# EAGLE design nanoheater (EAGLE 7.3.0)
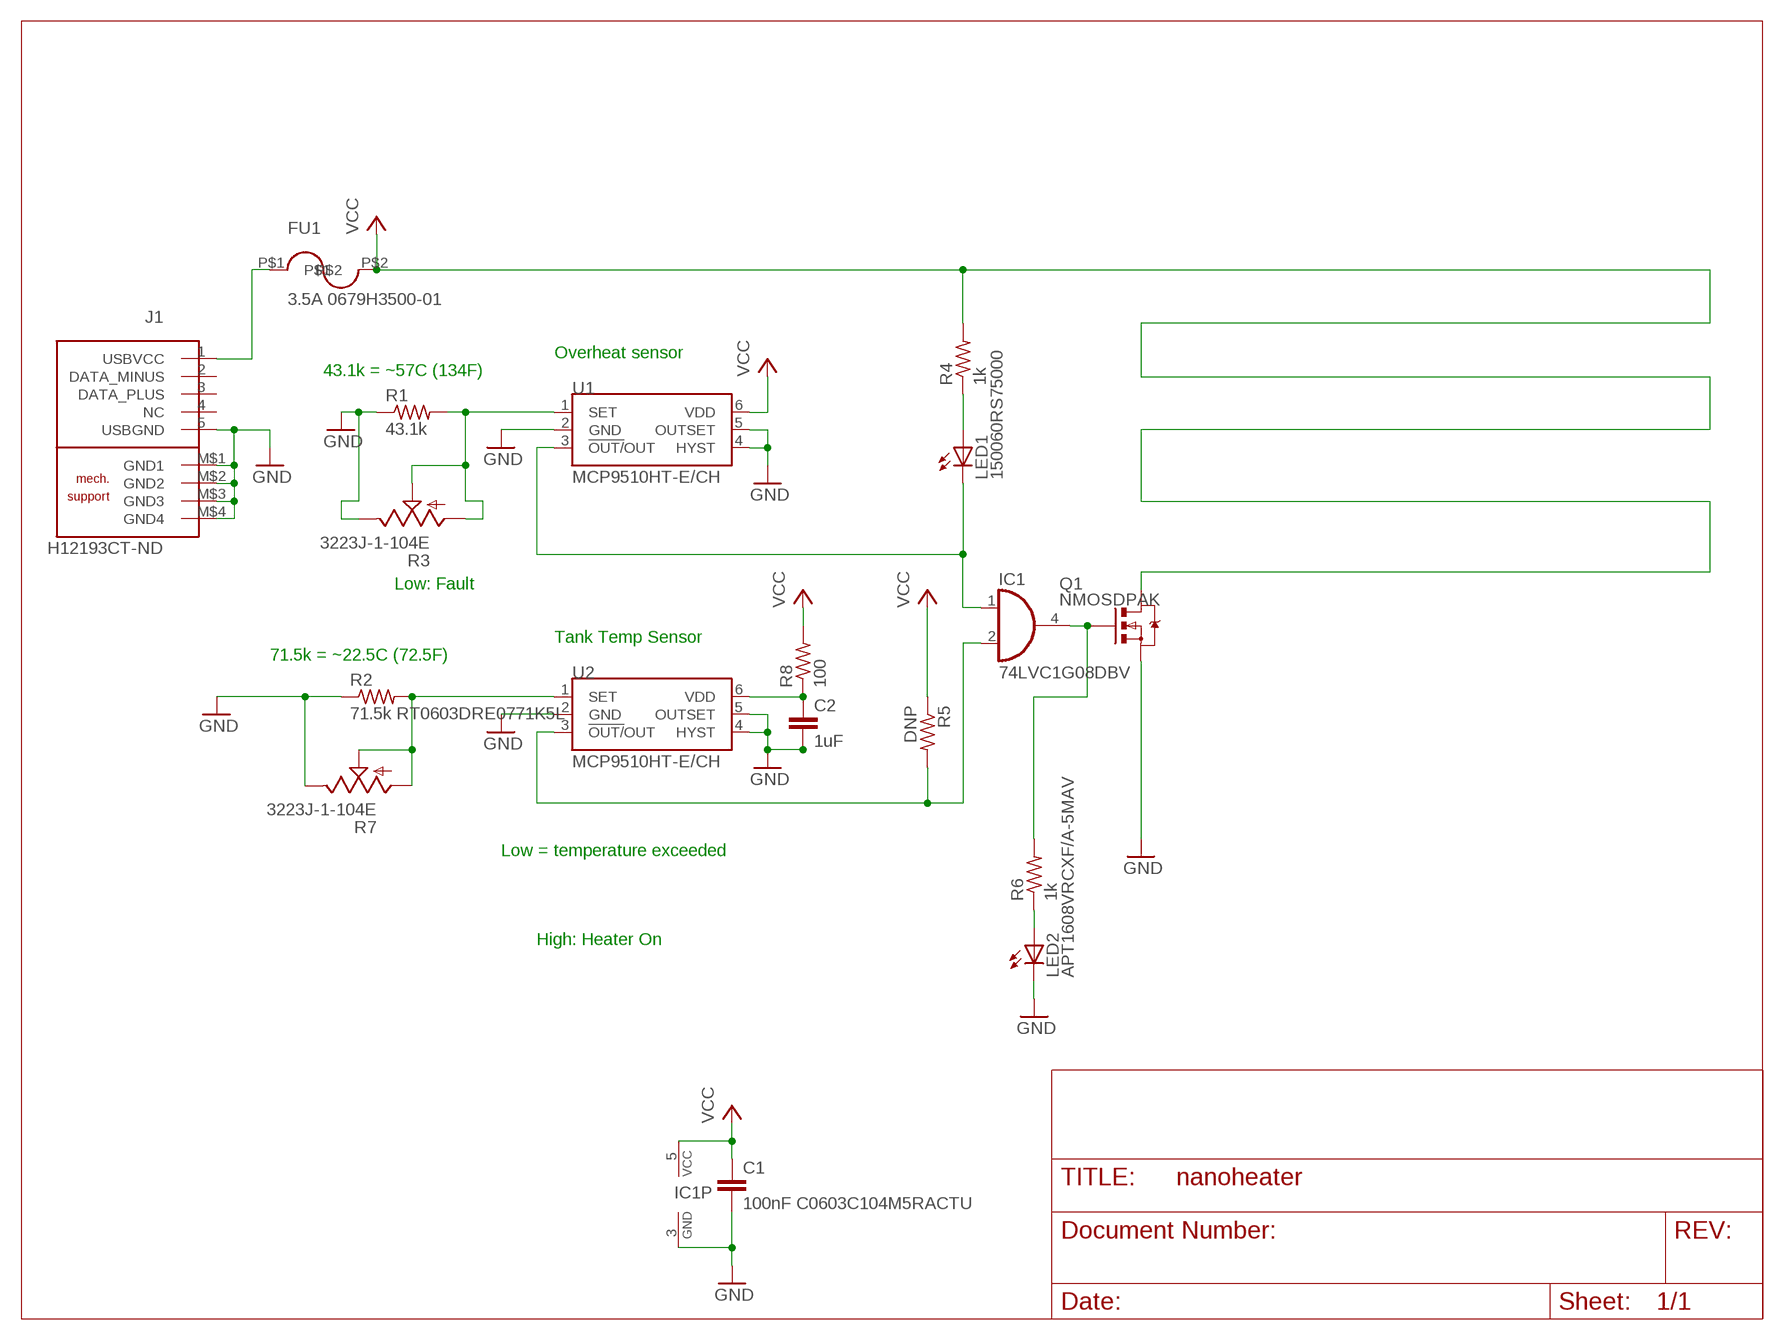
[diagram p0: schematic, sheet 1]

## Parts
C1  100nF C0603C104M5RACTU  C-EUC0603  [C0603]
C2  1uF  C-EUC0603  [C0603]
FU1  3.5A 0679H3500-01  FUSE_2410  [2410]
IC1  74LVC1G08DBV  [SOT23-5]
J1  H12193CT-ND  ZX62-B-5P_MICRO_USBW  [ZX62WD1-B-5PC_MICRO_USB]
LED1  150060RS75000  LEDCHIP-LED0603  [CHIP-LED0603]
LED2  APT1608VRCXF/A-5MAV  LEDCHIP-LED0603  [CHIP-LED0603]
Q1  NMOSDPAK  [DPAK]
R1  43.1k  R-US_R0603  [R0603]
R2  71.5k RT0603DRE0771K5L  R-US_R0603  [R0603]
R3  3223J-1-104E  TRIM_US-3223J  [3223J]
R4  1k  R-US_R0603  [R0603]
R5  DNP  R-US_R0603  [R0603]
R6  1k  R-US_R0603  [R0603]
R7  3223J-1-104E  TRIM_US-3223J  [3223J]
R8  100  R-US_R0603  [R0603]
U1  MCP9510HT-E/CH  MCP9509_9510  [SOT23-6]
U2  MCP9510HT-E/CH  MCP9509_9510  [SOT23-6]

## Nets
GND: C1.2 C2.2 IC1.3(GND) J1.5(USBGND) J1.M$1(GND1) J1.M$2(GND2) J1.M$3(GND3) J1.M$4(GND4) LED2.C Q1.3(S) R1.1 R2.1 R3.3(E) R7.3(E) U1.2(GND) U1.4(HYST) U1.5(OUTSET) U2.2(GND) U2.4(HYST) U2.5(OUTSET)
N$1: IC1.1(I0) LED1.C U1.3(!OUT/!OUT)
N$2: IC1.2(I1) R5.2 U2.3(!OUT/!OUT)
N$3: FU1.P$1 J1.1(USBVCC)
N$4: IC1.4(O) Q1.1(G) R6.2
N$5: LED1.A R4.1
N$6: R1.2 R3.1(A) R3.2(S) U1.1(SET)
N$8: LED2.A R6.1
N$10: R2.2 R7.1(A) R7.2(S) U2.1(SET)
N$11: C2.1 R8.1 U2.6(VDD)
VCC: C1.1 FU1.P$2 IC1.5(VCC) Q1.2(D) R4.2 R5.1 R8.2 U1.6(VDD)
Unconnected: J1.2(DATA_MINUS) J1.3(DATA_PLUS) J1.4(NC)

## Notes on the sheet
- Overheat sensor
- 43.1k = ~57C (134F)
- Low: Fault
- Tank Temp Sensor
- 71.5k = ~22.5C (72.5F)
- Low = temperature exceeded
- High: Heater On

## Library data of the parts
C1 C2 = rcl:C-EU: CAPACITOR, European symbol
FU1 = tim:FUSE_2410
IC1 = 74xx-little-de:74*1G08: 2-input AND gate
J1 = mideeval:ZX62-B-5P_MICRO_USB: Hirose micro-USB B end, SMT bottom mount. 20120627 / tgipson
LED1 LED2 = led:LED: LED OSRAM: - CHIPLED LG R971, LG N971, LY N971, LG Q971, LY Q971, LO R971, LY R971 LH N974, LH R974 LS Q976, LO Q976, LY Q976 LO Q996 - Hyper CHIPLED LW Q18S LB Q993, LB Q99A, LB R99A - SideLED LS A670, LO A670, LY A670, LG A670, LP A670 LB A673, LV A673, LT A673, LW A673 LH A674 LY A675 LS A676, LA A676, LO A676, LY A676, LW A676 LS A679, LY A679, LG A679 - Hyper Micro SIDELED® LS Y876, LA Y876, LO Y876, LY Y876 LT Y87S - SmartLED LW L88C, LW L88S LB L89C, LB L89S, LG L890 LS L89K, LO L89K, LY L89K LS L896, LA L896, LO L896, LY L896 - TOPLED LS T670, LO T670, LY T670, LG T670, LP T670 LSG T670, LSP T670, LSY T670, LOP T670, LYG T670 LG T671, LOG T671, LSG T671 LB T673, LV T673, LT T673, LW T673 LH T674 LS T676, LA T676, LO T676, LY T676, LB T676, LH T676, LSB T676, LW T676 LB T67C, LV T67C, LT T67C, LS T67K, LO T67K, LY T67K, LW E67C LS E67B, LA E67B, LO E67B, LY E67B, LB E67C, LV E67C, LT E67C LW T67C LS T679, LY T679, LG T679 LS T770, LO T770, LY T770, LG T770, LP T770 LB T773, LV T773, LT T773, LW T773 LH T774 LS E675, LA E675, LY E675, LS T675 LS T776, LA T776, LO T776, LY T776, LB T776 LHGB T686 LT T68C, LB T68C - Hyper Mini TOPLED® LB M676 - Mini TOPLED Santana® LG M470 LS M47K, LO M47K, LY M47K Source: http://www.osram.convergy.de LUXEON: - LUMILED® LXK2-PW12-R00, LXK2-PW12-S00, LXK2-PW14-U00, LXK2-PW14-V00 LXK2-PM12-R00, LXK2-PM12-S00, LXK2-PM14-U00 LXK2-PE12-Q00, LXK2-PE12-R00, LXK2-PE12-S00, LXK2-PE14-T00, LXK2-PE14-U00 LXK2-PB12-K00, LXK2-PB12-L00, LXK2-PB12-M00, LXK2-PB14-N00, LXK2-PB14-P00, LXK2-PB14-Q00 LXK2-PR12-L00, LXK2-PR12-M00, LXK2-PR14-Q00, LXK2-PR14-R00 LXK2-PD12-Q00, LXK2-PD12-R00, LXK2-PD12-S00 LXK2-PH12-R00, LXK2-PH12-S00 LXK2-PL12-P00, LXK2-PL12-Q00, LXK2-PL12-R00 Source: www.luxeon.com KINGBRIGHT: KA-3528ASYC Source: www.kingbright.com
Q1 = tim:NMOS
R1 R2 R4-R6 R8 = rcl:R-US_: RESISTOR, American symbol
R3 R7 = pot:TRIM_US-: POTENTIOMETER
U1 U2 = tim:MCP9509_9510

## Board
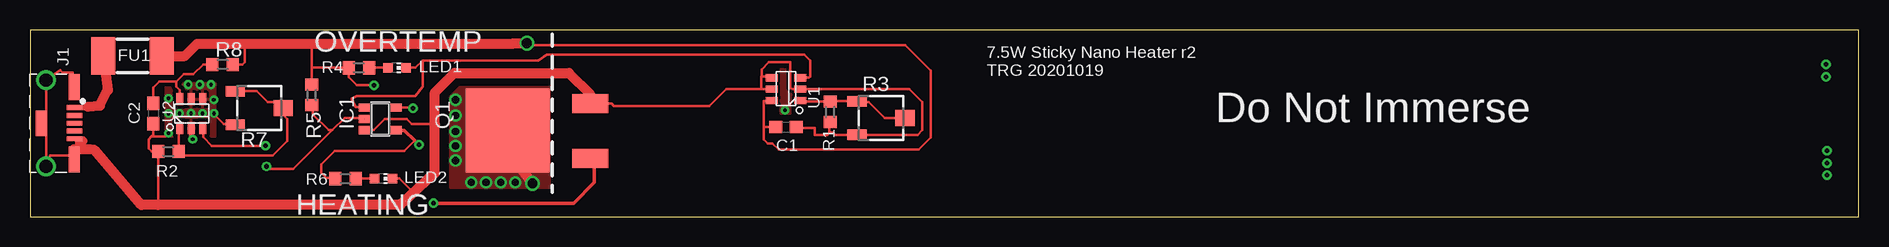
[diagram p1: board, top side]
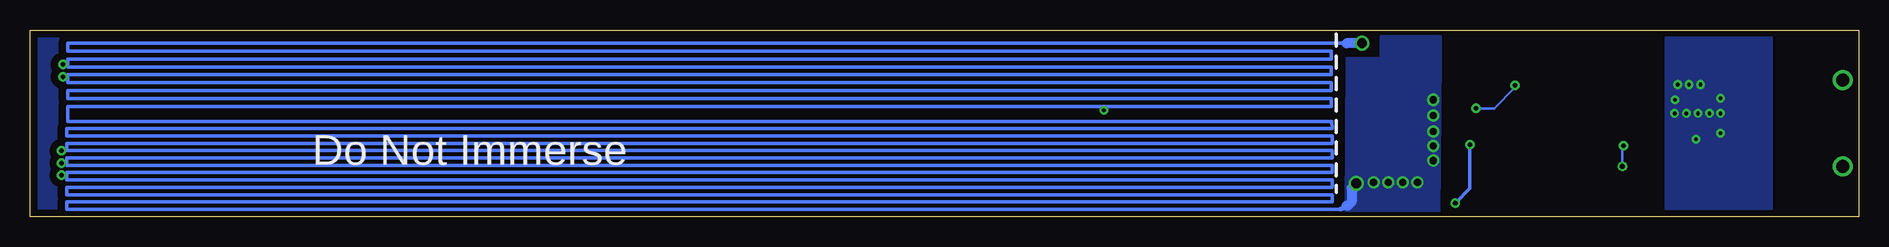
[diagram p2: board, bottom side, seen from below]

Size 152.4 x 15.59 mm. Coordinates in mm from the lower left corner, seen from the top.
Outline: 0,0 152.4,0 152.4,15.59 0,15.59 0,0
Copper layers (1*16): Top 0.035mm / dielectric 1.5mm / Bottom 0.035mm
Design rules "default *": minimum track width 10mil, minimum drill 24mil, track to track 8mil, track to pad 8mil, pad to pad 8mil, via to via 8mil, smd to smd 8mil, copper to edge 15mil, drill to drill 8mil, minimum pad ring 10mil, minimum via ring 8mil, stop-mask expansion 4mil, vias tented up to drill 0mil, thermal gap 10mil

### Footprints (pad centres in the part's own frame; a part is rotated, then mirrored left to right if it is on the bottom)
C0603 = smd 1.1 x 1: 1 -0.85,0; 2 0.85,0
2410 = smd 2 x 3.15: P$1 -2.45,0; P$2 2.45,0
SOT23-5 = smd 0.69 x 0.99: 1 -0.95,-1.29; 2 0,-1.29; 3 0.95,-1.29; 4 0.95,1.3; 5 -0.95,1.3
ZX62WD1-B-5PC_MICRO_USB = smd 0.4 x 1.3: 1 -1.3,1.965; 2 -0.65,1.965; 3 0,1.965; 4 0.65,1.965; 5 1.3,1.965 | smd 2.15 x 0.9: M$1 -3.025,1.935; M$2 3.027,1.933; M$5 0,-0.815 | drill 1.1 pad 1.27: M$3 -3.61,-0.415; M$4 3.61,-0.415
CHIP-LED0603 = smd 0.8 x 0.8: A 0,-0.75; C 0,0.75
DPAK = smd 1.6 x 3: 1 -2.269,-1.515; 3 2.311,-1.515 | smd 7 x 7: 2 0.046,5.34
R0603 = smd 1 x 1.1: 1 -0.85,0; 2 0.85,0
3223J = smd 1.6 x 0.9: 1 -2,1.4; 3 -2,-1.4 | smd 1.6 x 1.3: 2 2,0
SOT23-6 = smd 0.6 x 1: 1 -0.95,-1.2; 2 0,-1.2; 3 0.95,-1.2; 4 0.95,1.2; 5 0,1.2; 6 -0.95,1.2

### Placement (x,y rotation side)
C1  62.99,7.47 0 top
C2  10.26,8.61 270 top
FU1  8.53,13.41 0 top
IC1  29.18,8.15 270 top
J1  1.75,7.8 270 top
LED1  30.58,12.42 270 top
LED2  29.46,3.17 270 top
Q1  45.16,7.14 90 top
R1  66.67,8.74 90 top
R2  11.53,5.44 0 top
R3  70.92,8.23 0 top
R4  27.41,12.42 180 top
R5  23.47,10.16 270 top
R6  26.29,3.17 180 top
R7  19.1,9.07 0 top
R8  16.05,12.7 0 top
U1  62.99,10.64 90 top
U2  13.44,8.61 0 top

### Tracks (layer width: path | path; a pad name or v marks a point on that pad's centre or on a via)
GND  (via drill 0.3)
  Top 0.203: 61.79,11.68 60.94,11.68 | 60.94,11.68 60.94,10.64 | 60.94,10.64 U1.5 | 63.84,7.42 65.41,7.42 65.41,6.81 66.42,6.81 66.62,7.01 | 66.62,7.01 66.62,7.84 | 60.94,11.68 60.96,11.71 60.96,12.27 61.57,12.88 63.35,12.88 63.35,10.74 63.55,10.64 U1.2 67.41,10.64 67.44,10.67 73.25,10.67 74.37,9.55 74.37,7.21 73.99,6.83 R3.3 68.89,6.81 67.16,6.81 66.95,7.01 66.62,7.01 | 10.11,6.68 9.88,6.45 9.88,5.69 10.13,5.44 R2.1 10.68,4.63 10.67,4.34 10.67,0.96 | 10.11,6.68 10.26,6.83 C2.2 | 60.94,10.64 58.01,10.64 56.62,9.25 48.67,9.25 48.46,9.45 Q1.3 | 66.84,8.05 R1.1 | J1.M$1 3.56,12.01 2.74,12.01 2.54,12.22 J1.M$3 J1.M$4 1.7,5.11 3.56,5.11 3.94,5.49 J1.M$2 | v11.53,6.96 11.25,6.68 10.11,6.68 | 30.18,3.21 LED2.C 30.76,3.17 31.68,2.26 31.68,1.72 | IC1.3 27.91,7.21 28.65,7.21 29.57,8.13 31.39,8.13 31.8,7.72 33.73,7.72 | R7.3 17.05,7.72 16.15,7.72 15.34,8.53 v15.34,8.61
  Top 0.305: U1.4 61.79,11.68 | C1.2 63.84,7.42 | 66.62,7.84 R1.1
  Top 0.406: U2.2 13.44,6.33 | J1.5 4.47,6.5 4.47,6.3
  Top 0.61: 4.47,6.3 4.07,6.3 4.07,5.61
  Top 0.813: J1.M$2 3.66,5.61 4.07,5.61 4.27,5.61 5,5.61 5.38,5.56 9.27,0.96 10.67,0.96 30.86,0.96 31.68,1.72 33.73,3.63 33.73,7.72 33.73,10.36 35.36,11.99 44.91,11.99 46.68,10.22 Q1.3
  other vias: 14.38,8.61 13.41,8.61 12.45,8.61 11.53,8.61 11.53,9.88 13.18,11.02 14.15,11.02 15.09,11.02 15.32,9.75 13.56,6.45
  pour Bottom (no thermals): 7.26,14.94 16.1,14.94 16.1,0.66 7.26,0.66
  pour Top (isolate 0.305): 11.33,11.15 15.44,11.15 15.44,6.71 11.33,6.71
N$1
  Top 0.203: U1.3 64.91,11.59 65.02,11.71 65.02,13.03 64.52,13.54 43.08,13.54 42.37,13.03 32.72,13.03 | 32.72,13.03 32.11,12.42 LED1.C | IC1.1 27.85,9.14 27.13,9.14 26.82,9.75 26.82,9.86 27.23,10.06 32.11,10.06 32.72,10.87 32.72,13.03
N$2  (via drill 0.38)
  Top 0.203: U2.3 14.45,7.34 14.43,7.32 14.43,6.63 15.14,5.92 v19.61,5.92 | 19.81,4.29 v19.71,4.19 19.94,3.96 21.95,3.96 25.2,7.21 | IC1.2 27.82,8.23 26.21,8.23 25.2,7.21 | R5.2 23.57,9.21 23.57,8.53 24.89,7.21 25.2,7.21
  Bottom 0.203: v19.61,5.92 19.71,5.82 v19.71,4.19
N$3
  Top 0.406: J1.1 4.72,9.1
  Top 0.61: 4.72,9.1 4.83,9.17
  Top 0.813: 4.83,9.17 5.82,9.27 6.45,10.52 6.49,10.55 FU1.P$1
N$4  (via drill 0.38)
  Top 0.203: R6.2 25.36,3.25 24.69,3.25 24.28,3.66 24.28,4.37 25.4,5.49 31.19,5.49 32.05,6.35
  Top 0.305: Q1.1 47.04,4.5 47.04,2.85 45.31,1.12 v33.63,1.12 | v32.41,5.99 32.05,6.35 31.2,7.2 IC1.4
  Bottom 0.305: v33.63,1.12 32.41,2.34 v32.41,5.99
N$5
  Top 0.203: LED1.A R4.1
N$6
  Top 0.203: U1.1 64.3,9.59 R1.2 66.72,9.63 R3.1 69,9.55 69.9,9.55 71.22,8.23 R3.2
N$7
  pour Bottom (isolate 0.61): 148.87,15.34 152.22,15.34 152.22,0.43 148.87,0.43
N$8
  Top 0.203: LED2.A R6.1
N$10
  Top 0.203: U2.1 12.38,7.31 R2.2 12.51,5.11 20.22,5.11 21.44,6.33 21.44,8.13 21.1,8.46 R7.2 20.62,9.55 19.81,9.55 18.89,10.47 R7.1
N$11
  Top 0.203: C2.1 10.26,10.77 10.77,11.28 12.19,11.28 | R8.1 14.43,12.7 13.61,11.89 12.8,11.89 12.19,11.28 | U2.6 12.5,10.57 12.19,10.87 12.19,11.28
VCC  (via drill 0.3, 0.38, 0.6, 0.81)
  Top 0.203: U1.6 61.79,9.65 61.14,9.65 61.14,7.47 | 61.14,7.47 C1.1 | 23.47,12.42 R4.2 26.56,11.64 27.23,10.97 v28.65,10.97 | 61.14,7.47 61.14,6.45 61.47,6.12 61.85,6.12 62.38,5.59 74.07,5.59 75.08,6.6 75.08,12.19 72.95,14.33 41.55,14.33 v41.4,14.48 | R5.1 23.47,12.42 | 23.47,12.42 23.47,14.43 | IC1.5 31.84,9.1 v31.9,9.04 | R8.2 17.68,12.7 17.88,12.9 17.88,14.43
  Top 0.254: 41.02,3.89 39.82,5.09 Q1.2
  Top 0.813: v41.4,14.48 40.26,14.48 40.21,14.43 23.47,14.43 17.88,14.43 13.92,14.43 12.9,13.41 FU1.P$2 | v41.88,2.77 41.02,3.89
  Bottom 0.203: v62.92,8.89 62.89,8.91 62.89,9.2 | v31.9,9.04 30.38,9.04 28.65,10.77 v28.65,10.97 | v149.66,12.7 149.63,12.68 149.25,12.68 | v149.66,11.68 149.25,11.68 | v149.76,4.47 149.35,4.47 | v149.76,3.45 149.35,3.45 | v149.76,5.49 149.73,5.51 149.35,5.51
  Bottom 0.305: 42.67,14.48 149.25,14.48 149.25,13.82 43.94,13.82 43.94,13.16 149.25,13.16 149.25,12.68 149.25,12.5 43.94,12.5 43.94,11.84 149.25,11.84 149.25,11.68 149.25,11.18 43.94,11.18 43.94,10.52 149.25,10.52 149.25,9.86 43.94,9.86 43.94,9.2 62.89,9.2 149.25,9.2 149.25,7.92 43.92,7.92 43.89,7.34 149.35,7.34 149.35,6.73 43.89,6.73 43.89,6.12 149.35,6.12 149.35,5.51 43.89,5.51 43.89,4.9 149.35,4.9 149.35,4.47 149.35,4.29 43.89,4.29 43.89,3.68 149.35,3.68 149.35,3.45 149.35,3.07 43.89,3.07 43.89,2.44 149.35,2.44 149.35,1.83 43.89,1.83 43.89,1.22 149.35,1.22 149.35,0.61 43.18,0.61
  Bottom 0.406: 42.67,0.91 42.98,0.71 43.18,0.61
  Bottom 0.813: v41.4,14.48 42.67,14.48 | v41.88,2.77 42.27,2.39 42.27,1.22 42.57,0.91 42.67,0.91
  other vias: 40.44,2.84 39.22,2.84 38,2.84 36.78,2.84 35.46,4.67 35.46,5.89 35.46,7.11 35.46,8.43 35.46,9.75
  pour Top: 62.56,12.32 62.56,8.61 63.37,8.61 63.37,9.32 63.55,9.32 63.55,10.21 63.2,10.21 63.25,12.29 62.79,12.32
  pour Bottom (isolate 0.305, no thermals): 34.85,13.41 34.85,15.04 39.83,15.04 39.83,13.21 42.67,13.21 42.77,0.2 34.95,0.1
  pour Top (isolate 0.61, no thermals): 43.28,10.87 35.05,10.87 35.05,2.44 43.28,2.44

### Text on the board
tPlace: OVERTEMP | 7.5W Sticky Nano Heater r2 / TRG 20201019 | Do Not Immerse | HEATING
bPlace: Do Not Immerse
Document: 1905mm@12mil (75") | run length-freq-ri